# Altium schematic sheet Sheet2.SchDoc
size A4
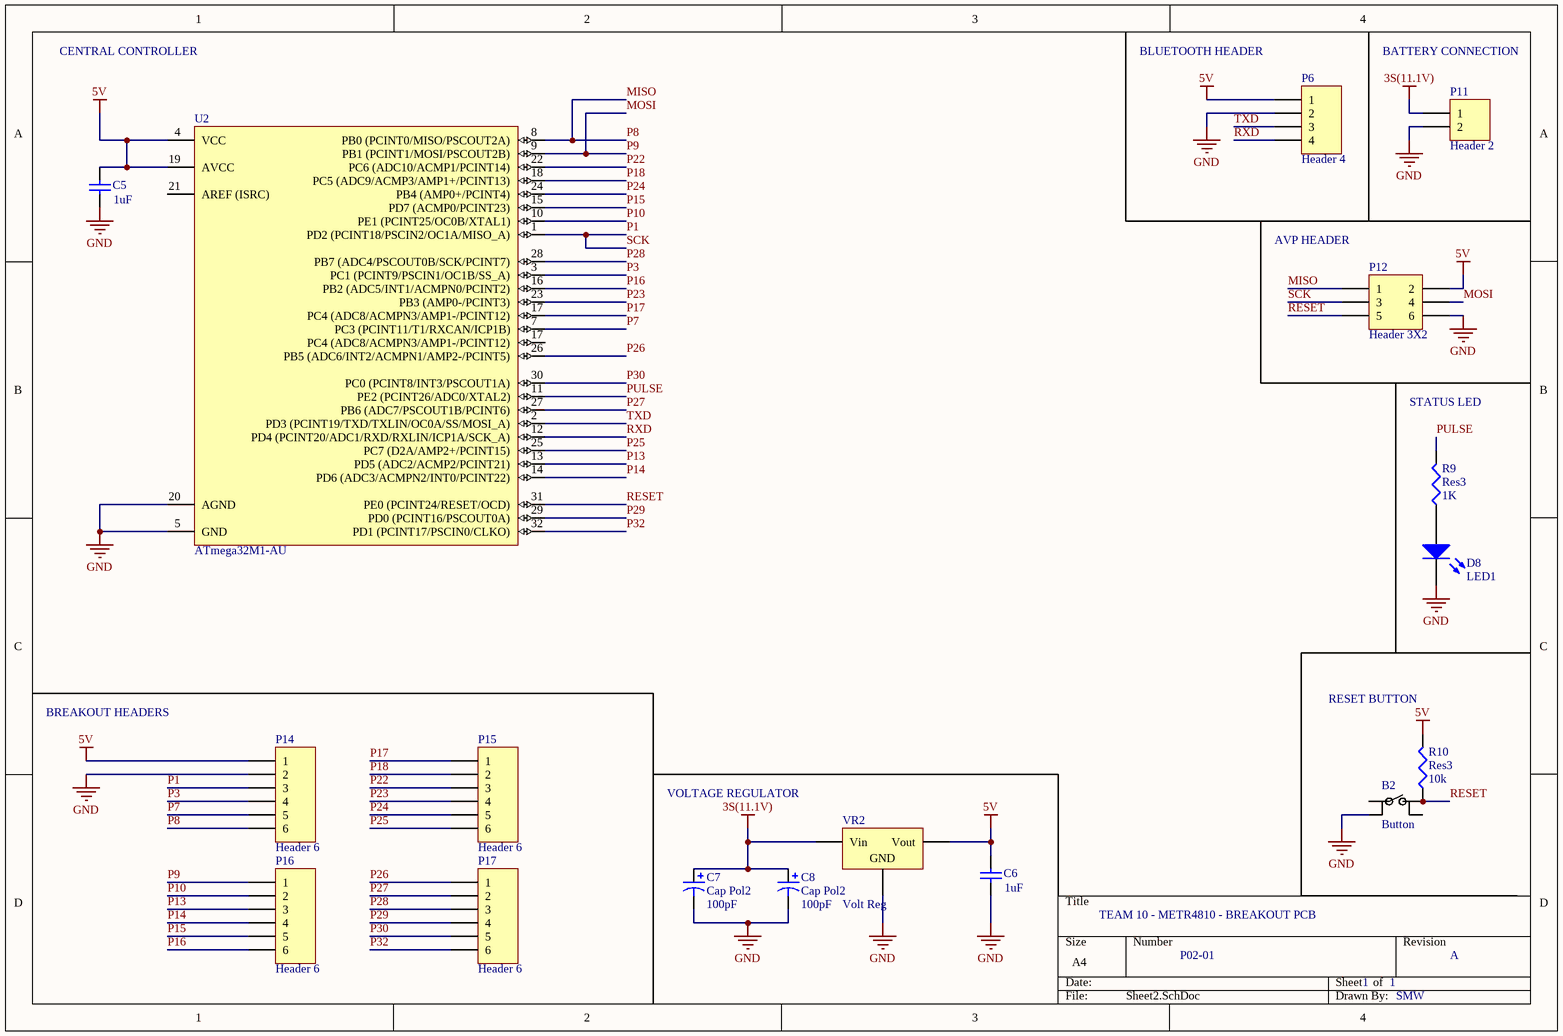
[diagram p0: Sheet2.SchDoc]

## Parts
B2  Button  [SMT Tactile Button]
C5  value 1uF  [1608[0603]]  (hidden comment: Cap)
C6  value 1uF  [1608[0603]]  (hidden comment: Cap)
C7  Cap Pol2  value 100pF  [CAPAE9983X105M]
C8  Cap Pol2  value 100pF  [CAPAE9983X105M]
D8  LED1  [L0603]
P6  Header 4  [HDR1X4]
P11  Header 2  [HDR1X2]
P12  Header 3X2  [HDR2X3]
P14  Header 6  [HDR1X6]
P15  Header 6  [HDR1X6]
P16  Header 6  [HDR1X6]
P17  Header 6  [HDR1X6]
R9  Res3  value 1K  [J1-0603]
R10  Res3  value 10k  [J1-0603]
U2  ATmega32M1-AU  [32A_L]
VR2  Volt Reg  [D2PAK_N]

## Nets
3S(11.1V): C7.1 C8.1 P11.1 VR2.1(Vin)
5V: C5.2 C6.2 P6.1 P12.2 P14.1 R10.2 U2.4(VCC) U2.19(AVCC) VR2.3(Vout)
GND: B2.2 C5.1 C6.1 C7.2 C8.2 D8.2(K) P6.2 P11.2 P12.6 P14.2 U2.5(GND) U2.20(AGND) VR2.2(GND)
MISO: P12.1 P14.6 U2.8(PB0_(PCINT0/MISO/PSCOUT2A))  [also labelled P8]
MOSI: P12.4 P16.1 U2.9(PB1_(PCINT1/MOSI/PSCOUT2B))  [also labelled P9]
P1: P12.3 P14.3 U2.1(PD2_(PCINT18/PSCIN2/OC1A/MISO_A))  [also labelled SCK]
P3: P14.4 U2.3(PC1_(PCINT9/PSCIN1/OC1B/SS_A))
P7: P14.5 U2.7(PC3_(PCINT11/T1/RXCAN/ICP1B))
P10: P16.2 U2.10(PE1_(PCINT25/OC0B/XTAL1))
P13: P16.3 U2.13(PD5_(ADC2/ACMP2/PCINT21))
P14: P16.4 U2.14(PD6_(ADC3/ACMPN2/INT0/PCINT22))
P15: P16.5 U2.15(PD7_(ACMP0/PCINT23))
P16: P16.6 U2.16(PB2_(ADC5/INT1/ACMPN0/PCINT2))
P17: P15.1 U2.17(PC4_(ADC8/ACMPN3/AMP1-/PCINT12))
P18: P15.2 U2.18(PC5_(ADC9/ACMP3/AMP1+/PCINT13))
P22: P15.3 U2.22(PC6_(ADC10/ACMP1/PCINT14))
P23: P15.4 U2.23(PB3_(AMP0-/PCINT3))
P24: P15.5 U2.24(PB4_(AMP0+/PCINT4))
P25: P15.6 U2.25(PC7_(D2A/AMP2+/PCINT15))
P26: P17.1 U2.26(PB5_(ADC6/INT2/ACMPN1/AMP2-/PCINT5))
P27: P17.2 U2.27(PB6_(ADC7/PSCOUT1B/PCINT6))
P28: P17.3 U2.28(PB7_(ADC4/PSCOUT0B/SCK/PCINT7))
P29: P17.4 U2.29(PD0_(PCINT16/PSCOUT0A))
P30: P17.5 U2.30(PC0_(PCINT8/INT3/PSCOUT1A))
P32: P17.6 U2.32(PD1_(PCINT17/PSCIN0/CLKO))
PULSE: R9.2 U2.11(PE2_(PCINT26/ADC0/XTAL2))
RESET: B2.4 P12.5 R10.1 U2.31(PE0_(PCINT24/RESET/OCD))
RXD: P6.4 U2.12(PD4_(PCINT20/ADC1/RXD/RXLIN/ICP1A/SCK_A))
TXD: P6.3 U2.2(PD3_(PCINT19/TXD/TXLIN/OC0A/SS/MOSI_A))
NetD8_1: D8.1(A) R9.1

Not connected (* = marked no-connect by the designer): B2 1 3; U2 21(AREF_(ISRC))

## Notes on the sheet
- CENTRAL CONTROLLER
- BLUETOOTH HEADER
- BATTERY CONNECTION
- (near P12) AVP HEADER
- STATUS LED
- BREAKOUT HEADERS
- (near R10) RESET BUTTON
- VOLTAGE REGULATOR
- TEAM 10 - METR4810 - BREAKOUT PCB
- P02-01
- 1
- A
- SMW

## Library data of the parts
B2 = Switch
C5 C6 = Cap: Capacitor; Published: 8-Jun-2000; LatestRevisionDate: 17-Jul-2002; LatestRevisionNote: Re-released for DXP Platform.; PackageReference: RAD-0.3; Publisher: Altium Limited; PackageDescription: Radial Cap, Thru-Hole; 2 Leads; 0.3 in Pin Spacing
C7 C8 = Cap Pol2: Polarized Capacitor (Axial); Published: 8-Jun-2000; LatestRevisionDate: 17-Jul-2002; LatestRevisionNote: Re-released for DXP Platform.; PackageReference: POLAR0.8; Publisher: Altium Limited; PackageDescription: Polarized Capacitor; 2 Leads
D8 = LED1: Typical RED GaAs LED; Published: 8-Jun-2000; LatestRevisionDate: 08-Jul-2005; LatestRevisionNote: Mech Layer 1 removed.; PackageReference: LED-1; Publisher: Altium Limited; PackageDescription: LED; 2 Leads
P6 = Header 4: Header, 4-Pin; LatestRevisionDate: 17-Jul-2002; LatestRevisionNote: Re-released for DXP Platform.; Publisher: Altium Limited
P11 = Header 2: Header, 2-Pin; LatestRevisionDate: 17-Jul-2002; LatestRevisionNote: Re-released for DXP Platform.; Publisher: Altium Limited
P12 = Header 3X2: Header, 3-Pin, Dual row; LatestRevisionDate: 17-Jul-2002; LatestRevisionNote: Re-released for DXP Platform.; Publisher: Altium Limited
P14-P17 = Header 6: Header, 6-Pin; LatestRevisionDate: 17-Jul-2002; LatestRevisionNote: Re-released for DXP Platform.; Publisher: Altium Limited
R9 R10 = Res3: Resistor; Published: 8-Jun-2000; LatestRevisionDate: 29-May-2009; LatestRevisionNote: IPC-7351 Footprint Added.; PackageReference: J1-0603; Publisher: Altium Limited; PackageDescription: Chip Resistor
U2 = ATmega32M1-AU: 8-bit AVR Microcontroller, 2.7-5.5V, 16MHz, 32KB Flash, 1KB EEPROM, 2KB SRAM, Industrial Grade (-40° to +85°C), 32-Pin TQFP; DatasheetVersion: revD, Nov-2010; PackageVersion: revC, Oct-2010; PackageReference: 32A; PackageDescription: 32-Lead, 7x7x1.0 mm Body, 0.8mm Lead Pitch, Thin Profile Plastic Quad Flat Package (TQFP); Code_JEDEC: MS-026-ABA; ComponentLink1Description: Manufacturer URL; ComponentLink1URL: http://www.atmel.com/; ComponentLink2Description: ATmega16M1/32M1/64M1 Datasheet; ComponentLink2URL: http://www.atmel.com/dyn/resources/prod_documents/doc8209.pdf; ComponentLink3Description: ATmega16M1/32M1/64M1 Summary; ComponentLink3URL: http://www.atmel.com/dyn/resources/prod_documents/8209S.pdf
VR2 = Volt Reg: Voltage Regulator; Published: 24-Mar-1999; LatestRevisionDate: 29-May-2009; LatestRevisionNote: IPC-7351 Footprint Added.; PackageReference: D2PAK; Publisher: Altium Limited; PackageDescription: 3-Pin Transistor Outline Package 2.54 mm Pitch, 15.1 mm Lead Span